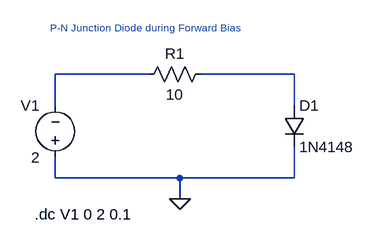
[diagram p0: schematic EEE_2_1.asc]
EEE_2_1.asc, the LTspice schematic file:
Version 4
SHEET 1 880 680
WIRE 160 112 16 112
WIRE 384 112 240 112
WIRE 16 160 16 112
WIRE 384 160 384 112
WIRE 16 272 16 240
WIRE 208 272 16 272
WIRE 384 272 384 224
WIRE 384 272 208 272
WIRE 208 304 208 272
FLAG 208 304 0
SYMBOL voltage 16 256 R180
WINDOW 0 24 96 Left 2
WINDOW 3 24 16 Left 2
SYMATTR InstName V1
SYMATTR Value 2
SYMBOL res 256 96 R90
WINDOW 0 0 56 VBottom 2
WINDOW 3 32 56 VTop 2
SYMATTR InstName R1
SYMATTR Value 10
SYMBOL diode 368 160 R0
SYMATTR InstName D1
SYMATTR Value 1N4148
TEXT 8 40 Left 1 ;P-N Junction Diode during Forward Bias
TEXT -16 328 Left 2 !.dc V1 0 2 0.1

The netlist it stands for:
* EEE_2_1.asc
V1 0 N001 2
R1 N002 N001 10
D1 N002 0 1N4148
.model D D
.lib standard.dio
* P-N Junction Diode during Forward Bias
.dc V1 0 2 0.1
.backanno
.end